# Altium schematic sheet ZynqPL.SchDoc: ZynqPL
size A3; Author: Carlos Barreiro; Organization: Escuela Técnica Superior de Ingeniería de Sistemas Informáticos de la Universidad Politécnica de Madrid; Address1: Campus Sur de la Universidad Politécnica de Madrid; Address2: Calle de Alan Turing, s/nº; Address3: Madrid 28031; Address4: España; DocumentNumber: 2; SheetNumber: 2; SheetTotal: 16
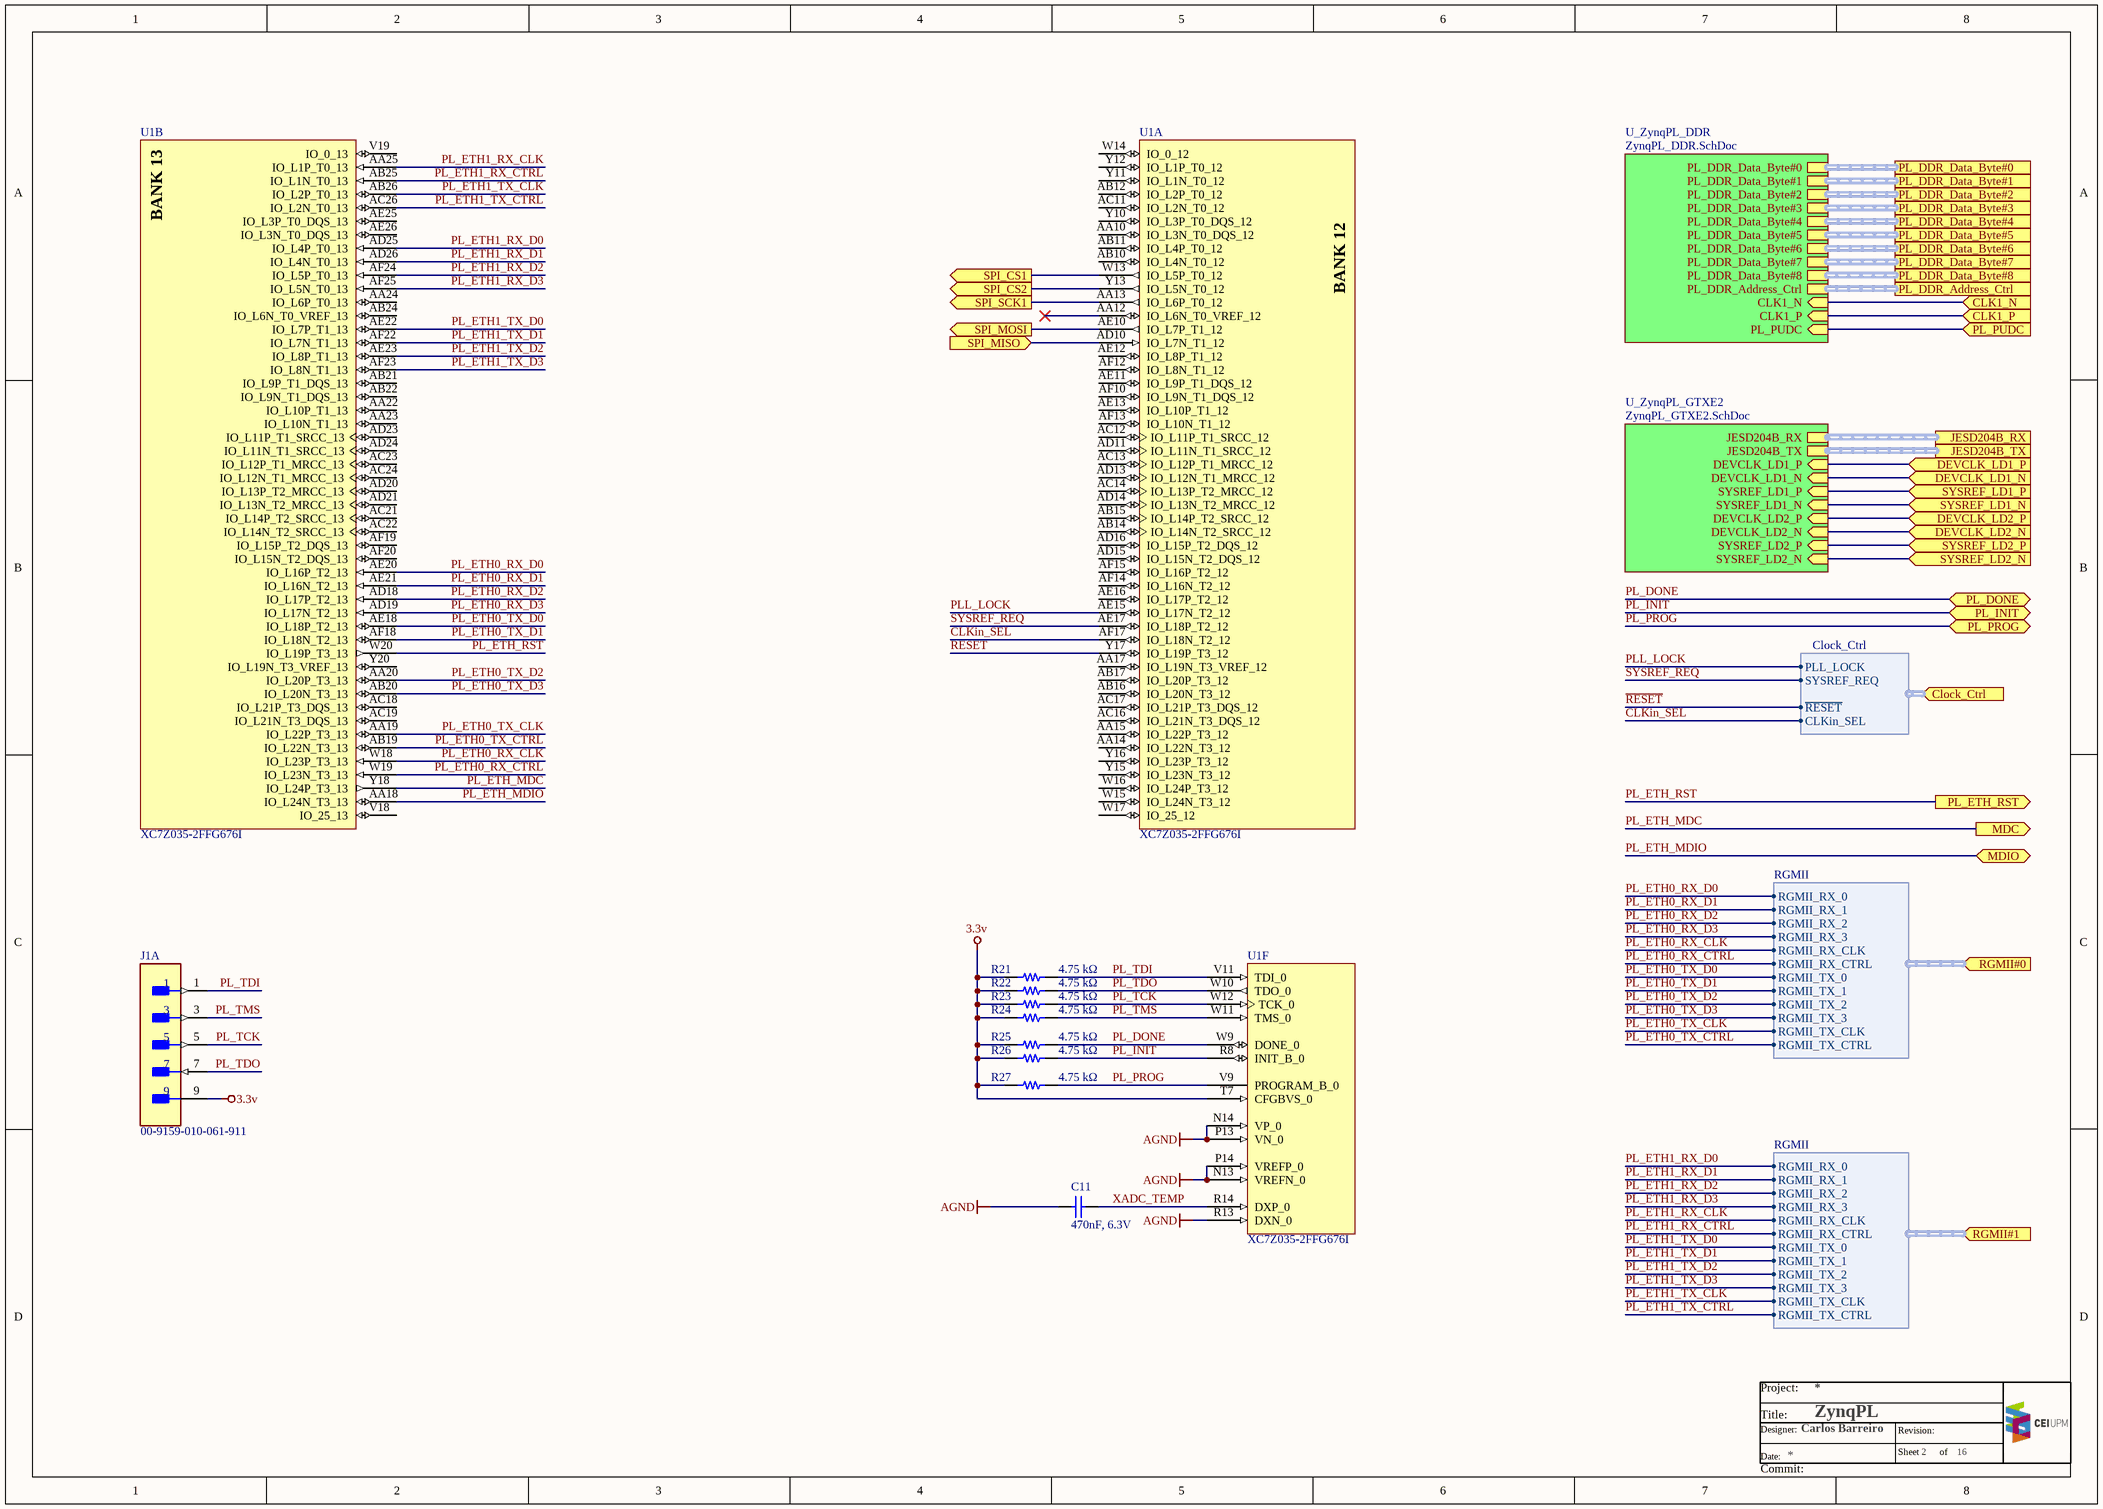
[diagram p0: ZynqPL.SchDoc]

## Parts
C11  470nF, 6.3V  [WURTH_WCAP-CSGP_0402]
J1  00-9159-010-061-911  [KYOCERA_00-9159-010-061-911]  (part A of 2)
R21  4.75 kΩ  [PANASONIC_ERJ2G_0402]
R22  4.75 kΩ  [PANASONIC_ERJ2G_0402]
R23  4.75 kΩ  [PANASONIC_ERJ2G_0402]
R24  4.75 kΩ  [PANASONIC_ERJ2G_0402]
R25  4.75 kΩ  [PANASONIC_ERJ2G_0402]
R26  4.75 kΩ  [PANASONIC_ERJ2G_0402]
R27  4.75 kΩ  [PANASONIC_ERJ2G_0402]
U1  XC7Z035-2FFG676I  [XILINX_FBG676]  (parts A,B,F of 13)

## Sub-sheets
U_ZynqPL_DDR = ZynqPL_DDR.SchDoc: PL_DDR_Data_Byte#0 (harness DDR_Data_Byte), PL_DDR_Data_Byte#1 (harness DDR_Data_Byte), PL_DDR_Data_Byte#2 (harness DDR_Data_Byte), PL_DDR_Data_Byte#3 (harness DDR_Data_Byte), PL_DDR_Data_Byte#4 (harness DDR_Data_Byte), PL_DDR_Data_Byte#5 (harness DDR_Data_Byte), PL_DDR_Data_Byte#6 (harness DDR_Data_Byte), PL_DDR_Data_Byte#7 (harness DDR_Data_Byte), PL_DDR_Address_Ctrl (harness DDR_Address_Ctrl), CLK1_N (in), CLK1_P (in), PL_DDR_Data_Byte#8 (harness DDR_Data_Byte), PL_PUDC (in)
U_ZynqPL_GTXE2 = ZynqPL_GTXE2.SchDoc: JESD204B_RX (harness JESD204B), JESD204B_TX (harness JESD204B), DEVCLK_LD1_P (in), SYSREF_LD2_N (in), DEVCLK_LD1_N (in), SYSREF_LD1_P (in), DEVCLK_LD2_N (in), DEVCLK_LD2_P (in), SYSREF_LD1_N (in), SYSREF_LD2_P (in)

## Ports
CLK1_N (in), CLK1_P (in), Clock_Ctrl (in, harness Clock_Ctrl), DEVCLK_LD1_N (in), DEVCLK_LD1_P (in), DEVCLK_LD2_N (in), DEVCLK_LD2_P (in), JESD204B_RX (harness JESD204B), JESD204B_TX (harness JESD204B), MDC (out), MDIO (bidir), PL_DDR_Address_Ctrl (harness DDR_Address_Ctrl), PL_DDR_Data_Byte#0 (harness DDR_Data_Byte), PL_DDR_Data_Byte#1 (harness DDR_Data_Byte), PL_DDR_Data_Byte#2 (harness DDR_Data_Byte), PL_DDR_Data_Byte#3 (harness DDR_Data_Byte), PL_DDR_Data_Byte#4 (harness DDR_Data_Byte), PL_DDR_Data_Byte#5 (harness DDR_Data_Byte), PL_DDR_Data_Byte#6 (harness DDR_Data_Byte), PL_DDR_Data_Byte#7 (harness DDR_Data_Byte), PL_DDR_Data_Byte#8 (harness DDR_Data_Byte), PL_DONE (bidir), PL_ETH_RST (out), PL_INIT (bidir), PL_PROG (bidir), PL_PUDC (in), RGMII#0 (in, harness RGMII), RGMII#1 (in, harness RGMII), SPI_CS1 (out), SPI_CS2 (out), SPI_MISO (in), SPI_MOSI (out), SPI_SCK1 (out), SYSREF_LD1_N (in), SYSREF_LD1_P (in), SYSREF_LD2_N (in), SYSREF_LD2_P (in)

## Harnesses
Clock_Ctrl: PLL_LOCK, SYSREF_REQ, ~{RESET}, CLKin_SEL
RGMII: RGMII_RX_0, RGMII_RX_1, RGMII_RX_2, RGMII_RX_3, RGMII_RX_CLK, RGMII_RX_CTRL, RGMII_TX_0, RGMII_TX_1, RGMII_TX_2, RGMII_TX_3, RGMII_TX_CLK, RGMII_TX_CTRL

## Nets
3.3v: J1.9 R21.1 R22.1 R23.1 R24.1 R25.1 R26.1 R27.1 U1.T7(CFGBVS_0)
AGND: C11.1 U1.N13(VREFN_0) U1.N14(VP_0) U1.P13(VN_0) U1.P14(VREFP_0) U1.R13(DXN_0)
CLK1_N: port CLK1_N, sheet U_ZynqPL_DDR/CLK1_N
CLK1_P: port CLK1_P, sheet U_ZynqPL_DDR/CLK1_P
CLKin_SEL: U1.AF17(IO_L18N_T2_12) ; port Clock_Ctrl.CLKin_SEL
DEVCLK_LD1_N: port DEVCLK_LD1_N, sheet U_ZynqPL_GTXE2/DEVCLK_LD1_N
DEVCLK_LD1_P: port DEVCLK_LD1_P, sheet U_ZynqPL_GTXE2/DEVCLK_LD1_P
DEVCLK_LD2_N: port DEVCLK_LD2_N, sheet U_ZynqPL_GTXE2/DEVCLK_LD2_N
DEVCLK_LD2_P: port DEVCLK_LD2_P, sheet U_ZynqPL_GTXE2/DEVCLK_LD2_P
PL_DONE: R25.2 U1.W9(DONE_0) ; port PL_DONE
PL_ETH0_RX_CLK: U1.W18(IO_L23P_T3_13) ; port RGMII#0.RGMII_RX_CLK
PL_ETH0_RX_CTRL: U1.W19(IO_L23N_T3_13) ; port RGMII#0.RGMII_RX_CTRL
PL_ETH0_RX_D0: U1.AE20(IO_L16P_T2_13) ; port RGMII#0.RGMII_RX_0
PL_ETH0_RX_D1: U1.AE21(IO_L16N_T2_13) ; port RGMII#0.RGMII_RX_1
PL_ETH0_RX_D2: U1.AD18(IO_L17P_T2_13) ; port RGMII#0.RGMII_RX_2
PL_ETH0_RX_D3: U1.AD19(IO_L17N_T2_13) ; port RGMII#0.RGMII_RX_3
PL_ETH0_TX_CLK: U1.AA19(IO_L22P_T3_13) ; port RGMII#0.RGMII_TX_CLK
PL_ETH0_TX_CTRL: U1.AB19(IO_L22N_T3_13) ; port RGMII#0.RGMII_TX_CTRL
PL_ETH0_TX_D0: U1.AE18(IO_L18P_T2_13) ; port RGMII#0.RGMII_TX_0
PL_ETH0_TX_D1: U1.AF18(IO_L18N_T2_13) ; port RGMII#0.RGMII_TX_1
PL_ETH0_TX_D2: U1.AA20(IO_L20P_T3_13) ; port RGMII#0.RGMII_TX_2
PL_ETH0_TX_D3: U1.AB20(IO_L20N_T3_13) ; port RGMII#0.RGMII_TX_3
PL_ETH1_RX_CLK: U1.AA25(IO_L1P_T0_13) ; port RGMII#1.RGMII_RX_CLK
PL_ETH1_RX_CTRL: U1.AB25(IO_L1N_T0_13) ; port RGMII#1.RGMII_RX_CTRL
PL_ETH1_RX_D0: U1.AD25(IO_L4P_T0_13) ; port RGMII#1.RGMII_RX_0
PL_ETH1_RX_D1: U1.AD26(IO_L4N_T0_13) ; port RGMII#1.RGMII_RX_1
PL_ETH1_RX_D2: U1.AF24(IO_L5P_T0_13) ; port RGMII#1.RGMII_RX_2
PL_ETH1_RX_D3: U1.AF25(IO_L5N_T0_13) ; port RGMII#1.RGMII_RX_3
PL_ETH1_TX_CLK: U1.AB26(IO_L2P_T0_13) ; port RGMII#1.RGMII_TX_CLK
PL_ETH1_TX_CTRL: U1.AC26(IO_L2N_T0_13) ; port RGMII#1.RGMII_TX_CTRL
PL_ETH1_TX_D0: U1.AE22(IO_L7P_T1_13) ; port RGMII#1.RGMII_TX_0
PL_ETH1_TX_D1: U1.AF22(IO_L7N_T1_13) ; port RGMII#1.RGMII_TX_1
PL_ETH1_TX_D2: U1.AE23(IO_L8P_T1_13) ; port RGMII#1.RGMII_TX_2
PL_ETH1_TX_D3: U1.AF23(IO_L8N_T1_13) ; port RGMII#1.RGMII_TX_3
PL_ETH_MDC: U1.Y18(IO_L24P_T3_13) ; port MDC
PL_ETH_MDIO: U1.AA18(IO_L24N_T3_13) ; port MDIO
PL_ETH_RST: U1.W20(IO_L19P_T3_13) ; port PL_ETH_RST
PL_INIT: R26.2 U1.R8(INIT_B_0) ; port PL_INIT
PL_PROG: R27.2 U1.V9(PROGRAM_B_0) ; port PL_PROG
PL_PUDC: port PL_PUDC, sheet U_ZynqPL_DDR/PL_PUDC
PL_TCK: J1.5 R23.2 U1.W12(TCK_0)
PL_TDI: J1.1 R21.2 U1.V11(TDI_0)
PL_TDO: J1.7 R22.2 U1.W10(TDO_0)
PL_TMS: J1.3 R24.2 U1.W11(TMS_0)
PLL_LOCK: U1.AE15(IO_L17N_T2_12) ; port Clock_Ctrl.PLL_LOCK
~{RESET}: U1.Y17(IO_L19P_T3_12) ; port Clock_Ctrl.~{RESET}
SPI_CS1: U1.W13(IO_L5P_T0_12) ; port SPI_CS1
SPI_CS2: U1.Y13(IO_L5N_T0_12) ; port SPI_CS2
SPI_MISO: U1.AD10(IO_L7N_T1_12) ; port SPI_MISO
SPI_MOSI: U1.AE10(IO_L7P_T1_12) ; port SPI_MOSI
SPI_SCK1: U1.AA13(IO_L6P_T0_12) ; port SPI_SCK1
SYSREF_LD1_N: port SYSREF_LD1_N, sheet U_ZynqPL_GTXE2/SYSREF_LD1_N
SYSREF_LD1_P: port SYSREF_LD1_P, sheet U_ZynqPL_GTXE2/SYSREF_LD1_P
SYSREF_LD2_N: port SYSREF_LD2_N, sheet U_ZynqPL_GTXE2/SYSREF_LD2_N
SYSREF_LD2_P: port SYSREF_LD2_P, sheet U_ZynqPL_GTXE2/SYSREF_LD2_P
SYSREF_REQ: U1.AE17(IO_L18P_T2_12) ; port Clock_Ctrl.SYSREF_REQ
XADC_TEMP: C11.2 U1.R14(DXP_0)

Not connected (* = marked no-connect by the designer): U1 AA10(IO_L3N_T0_DQS_12) AA12(IO_L6N_T0_VREF_12)* AA14(IO_L22N_T3_12) AA15(IO_L22P_T3_12) AA17(IO_L19N_T3_VREF_12) AA22(IO_L10P_T1_13) AA23(IO_L10N_T1_13) AA24(IO_L6P_T0_13) AB10(IO_L4N_T0_12) AB11(IO_L4P_T0_12) AB12(IO_L2P_T0_12) AB14(IO_L14N_T2_SRCC_12) AB15(IO_L14P_T2_SRCC_12) AB16(IO_L20N_T3_12) AB17(IO_L20P_T3_12) AB21(IO_L9P_T1_DQS_13) AB22(IO_L9N_T1_DQS_13) AB24(IO_L6N_T0_VREF_13) AC11(IO_L2N_T0_12) AC12(IO_L11P_T1_SRCC_12) AC13(IO_L12P_T1_MRCC_12) AC14(IO_L13P_T2_MRCC_12) AC16(IO_L21N_T3_DQS_12) AC17(IO_L21P_T3_DQS_12) AC18(IO_L21P_T3_DQS_13) AC19(IO_L21N_T3_DQS_13) AC21(IO_L14P_T2_SRCC_13) AC22(IO_L14N_T2_SRCC_13) AC23(IO_L12P_T1_MRCC_13) AC24(IO_L12N_T1_MRCC_13) AD11(IO_L11N_T1_SRCC_12) AD13(IO_L12N_T1_MRCC_12) AD14(IO_L13N_T2_MRCC_12) AD15(IO_L15N_T2_DQS_12) AD16(IO_L15P_T2_DQS_12) AD20(IO_L13P_T2_MRCC_13) AD21(IO_L13N_T2_MRCC_13) AD23(IO_L11P_T1_SRCC_13) AD24(IO_L11N_T1_SRCC_13) AE11(IO_L9P_T1_DQS_12) AE12(IO_L8P_T1_12) AE13(IO_L10P_T1_12) AE16(IO_L17P_T2_12) AE25(IO_L3P_T0_DQS_13) AE26(IO_L3N_T0_DQS_13) AF10(IO_L9N_T1_DQS_12) AF12(IO_L8N_T1_12) AF13(IO_L10N_T1_12) AF14(IO_L16N_T2_12) AF15(IO_L16P_T2_12) AF19(IO_L15P_T2_DQS_13) AF20(IO_L15N_T2_DQS_13) V18(IO_25_13) V19(IO_0_13) W14(IO_0_12) W15(IO_L24N_T3_12) W16(IO_L24P_T3_12) W17(IO_25_12) Y10(IO_L3P_T0_DQS_12) Y11(IO_L1N_T0_12) Y12(IO_L1P_T0_12) Y15(IO_L23N_T3_12) Y16(IO_L23P_T3_12) Y20(IO_L19N_T3_VREF_13)

## Buses and harness runs
harness port JESD204B_RX = sheet U_ZynqPL_GTXE2/JESD204B_RX
harness port JESD204B_TX = sheet U_ZynqPL_GTXE2/JESD204B_TX
harness port PL_DDR_Address_Ctrl = sheet U_ZynqPL_DDR/PL_DDR_Address_Ctrl
harness port PL_DDR_Data_Byte#0 = sheet U_ZynqPL_DDR/PL_DDR_Data_Byte#0
harness port PL_DDR_Data_Byte#1 = sheet U_ZynqPL_DDR/PL_DDR_Data_Byte#1
harness port PL_DDR_Data_Byte#2 = sheet U_ZynqPL_DDR/PL_DDR_Data_Byte#2
harness port PL_DDR_Data_Byte#3 = sheet U_ZynqPL_DDR/PL_DDR_Data_Byte#3
harness port PL_DDR_Data_Byte#4 = sheet U_ZynqPL_DDR/PL_DDR_Data_Byte#4
harness port PL_DDR_Data_Byte#5 = sheet U_ZynqPL_DDR/PL_DDR_Data_Byte#5
harness port PL_DDR_Data_Byte#6 = sheet U_ZynqPL_DDR/PL_DDR_Data_Byte#6
harness port PL_DDR_Data_Byte#7 = sheet U_ZynqPL_DDR/PL_DDR_Data_Byte#7
harness port PL_DDR_Data_Byte#8 = sheet U_ZynqPL_DDR/PL_DDR_Data_Byte#8

## Notes on the sheet
- Project:
- Title:
- Date:
- Designer:
- Sheet
- Revision:
- of
- Commit:
- (in symbol XC7Z035-2FFG676I, part A) BANK 12
- (in symbol XC7Z035-2FFG676I, part B) BANK 13

## Library data of the parts
C11 = 885012105004: WCAP-CSGP Multilayer Ceramic Chip Capacitor, General Purpose, size 0402, X5R, 470nF, 6.3V; Manufacturer: Wurth Elektronik; Rated Voltage: 6.3VDC; Isolation Resistance  min.: 0.2GOhm; Capacitance Tolerance: +/-20%; Dissipation Factor max.: 10%; Technical Reference: X5R0402474M6R3DFCT10000; ComponentLink1Description: Manufacturer; ComponentLink1URL: http://www.we-online.de; ComponentLink2Description: Datasheet; ComponentLink2URL: https://www.we-online.com/catalog/datasheet/885012105004.pdf; Operating Temperature: -55 to +85degC; Packaging: Tape and Reel; Manufacturer Part Number: 885012105004; Published Date: April 2021; Ceramic Type: X5R; Height: 0.5mm; Mounting Technology: SMT; Size: 0402; Capacitance: 470nF; Supplier 1: Digi-Key; Supplier 2: Mouser; Supplier Part Number 1: 732-7481-1-ND; Supplier Part Number 2: 710-885012105004
J1 = 00-9159-010-061-911: Coplanar Open Ended Card Edge Connector 10 Pin; Supplier 1: Digi-Key; Supplier Part Number 1: 478-009159010061911-ND
R21-R27 = ERJ2RKF4751X: General Purpose Thick Film Chip Resistors; Manufacturer: Panasonic; Power (0402): 0.1 W; Limiting Voltage (0402): 50; Maximum Voltage (0402): 100; Resistance Range (Ω): 1Ω to 100MΩ; AEC 200: Grade 0; Size (0402): 2GE; ComponentLink1Description: Catalog; ComponentLink1URL: https://industrial.panasonic.com/ww/products/pt/general-purpose-chip-resistors/models?op=search&model_status_current=1&page=0#model-list-search-results; Series: ERJ; Temperature Range (ºC): -55 to +155; Supplier 1: RSComponents; Supplier 2: Digi-Key; Supplier Part Number 1: 1065277; Supplier Part Number 2: P4.75KLCT-ND
U1 = XC7Z035-2FFG676I: 667 MHz Zynq™-7000 AP SoC, 130 PS I/O, 254 FPGA I/O, 676-Ball BGA, Speed Grade 1, Commercial Grade, Pb-Free; PartNumber: XC7Z035-2FBG676I; LUTs: 171,900; Extensible Block RAM (# 36Kb Blocks): 17.6Mb (500); Speed Grade: -2; Flip Flops: 343,800; ComponentLink5Description: Packaging and Pinout; ComponentLink4Description: Package File; ComponentLink5URL: http://www.xilinx.com/support/documentation/user_guides/ug865-Zynq-7000-Pkg-Pinout.pdf; Generic Part Number: XC7Z035; ComponentLink1Description: Datasheet; ComponentLink2Description: Package Specification; ComponentLink3URL: http://www.xilinx.com/support/documentation/data_sheets/ds191-XC7Z030-XC7Z045-data-sheet.pdf; ComponentLink1URL: http://www.xilinx.com/support/documentation/data_sheets/ds190-Zynq-7000-Overview.pdf; ComponentLink6Description: PCB and Layout Guide; Package: FBG676; ComponentLink3Description: DC and AC Switching Characteristics; ComponentLink6URL: http://www.xilinx.com/support/documentation/user_guides/ug483_7Series_PCB.pdf; RoHS: Pb-Free; ComponentLink4URL: http://www.xilinx.com/support/packagefiles/z7packages/xc7z030fbg676pkg.txt; ComponentLink2URL: http://www.xilinx.com/support/documentation/user_guides/ug475_7Series_Pkg_Pinout.pdf; PackageDescription: Flip-Chip Lidless BGA, Body 27 x 27 mm, 1.0 mm Pitch; Supplier 1: Digi-Key; Supplier 2: Mouser; Supplier Part Number 1: XC7Z035-2FFG676I-ND; Supplier Part Number 2: 217-XC7Z035-2FFG676I